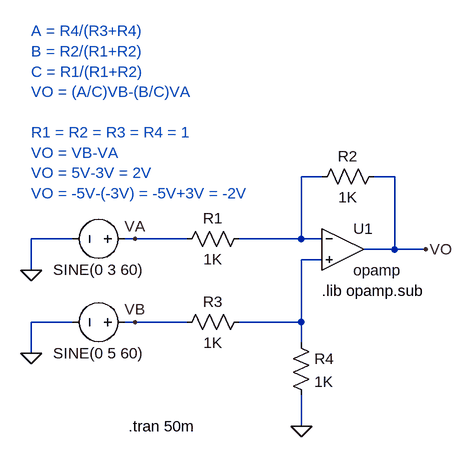
[diagram p0: schematic AMP07 - O Amplificador Subtrator.asc]
AMP07 - O Amplificador Subtrator.asc, the LTspice schematic file:
Version 4
SHEET 1 880 704
WIRE 144 16 112 16
WIRE 256 16 224 16
WIRE -240 112 -304 112
WIRE -144 112 -160 112
WIRE -64 112 -144 112
WIRE 112 112 112 16
WIRE 112 112 16 112
WIRE 144 112 112 112
WIRE 256 128 256 16
WIRE 256 128 208 128
WIRE 304 128 256 128
WIRE 144 144 112 144
WIRE -304 160 -304 112
WIRE -240 240 -304 240
WIRE -144 240 -160 240
WIRE -64 240 -144 240
WIRE 112 240 112 144
WIRE 112 240 16 240
WIRE 112 272 112 240
WIRE -304 288 -304 240
WIRE 112 400 112 352
FLAG 304 128 VO
FLAG -144 112 VA
FLAG -144 240 VB
FLAG -304 160 0
FLAG -304 288 0
FLAG 112 400 0
SYMBOL Opamps\\opamp 176 64 R0
SYMATTR InstName U1
SYMBOL res 240 0 R90
WINDOW 0 0 56 VBottom 2
WINDOW 3 32 56 VTop 2
SYMATTR InstName R2
SYMATTR Value 1K
SYMBOL voltage -144 112 R90
WINDOW 0 -32 56 Invisible 2
WINDOW 3 32 56 VTop 2
WINDOW 123 0 0 Left 2
WINDOW 39 0 0 Left 2
SYMATTR InstName V1
SYMATTR Value SINE(0 3 60)
SYMBOL voltage -144 240 R90
WINDOW 0 -32 56 Invisible 2
WINDOW 3 32 56 VTop 2
WINDOW 123 0 0 Left 2
WINDOW 39 0 0 Left 2
SYMATTR InstName V2
SYMATTR Value SINE(0 5 60)
SYMBOL res 32 224 R90
WINDOW 0 0 56 VBottom 2
WINDOW 3 32 56 VTop 2
SYMATTR InstName R3
SYMATTR Value 1K
SYMBOL res 32 96 R90
WINDOW 0 0 56 VBottom 2
WINDOW 3 32 56 VTop 2
SYMATTR InstName R1
SYMATTR Value 1K
SYMBOL res 96 256 R0
SYMATTR InstName R4
SYMATTR Value 1K
TEXT 144 192 Left 2 !.lib opamp.sub
TEXT -304 -208 Left 2 ;A = R4/(R3+R4)\nB = R2/(R1+R2)\nC = R1/(R1+R2)\nVO = (A/C)VB-(B/C)VA\n \nR1 = R2 = R3 = R4 = 1\nVO = VB-VA\nVO = 5V-3V = 2V\nVO = -5V-(-3V) = -5V+3V = -2V
TEXT -154 400 Left 2 !.tran 50m

The netlist it stands for:
* AMP07 - O Amplificador Subtrator.asc
XU1 N001 N002 VO opamp Aol=100K GBW=10Meg  ; pins invin noninvin out
R2 VO N001 1K
V1 VA 0 SINE(0 3 60)
V2 VB 0 SINE(0 5 60)
R3 N002 VB 1K
R1 N001 VA 1K
R4 N002 0 1K
.lib opamp.sub
* A = R4/(R3+R4)
* B = R2/(R1+R2)
* C = R1/(R1+R2)
* VO = (A/C)VB-(B/C)VA
* R1 = R2 = R3 = R4 = 1
* VO = VB-VA
* VO = 5V-3V = 2V
* VO = -5V-(-3V) = -5V+3V = -2V
.tran 50m
.backanno
.end